# Altium schematic sheet PowerSupply.SchDoc
size 420 x 297 mm; DocumentNumber: САНП.*; _Razrabotal: {Разработал}; _Proveril: {Проверил}; _TKontr: {Т.контр}; _NKontr: {Н.контр}; _Utverdil: {Утвердил}
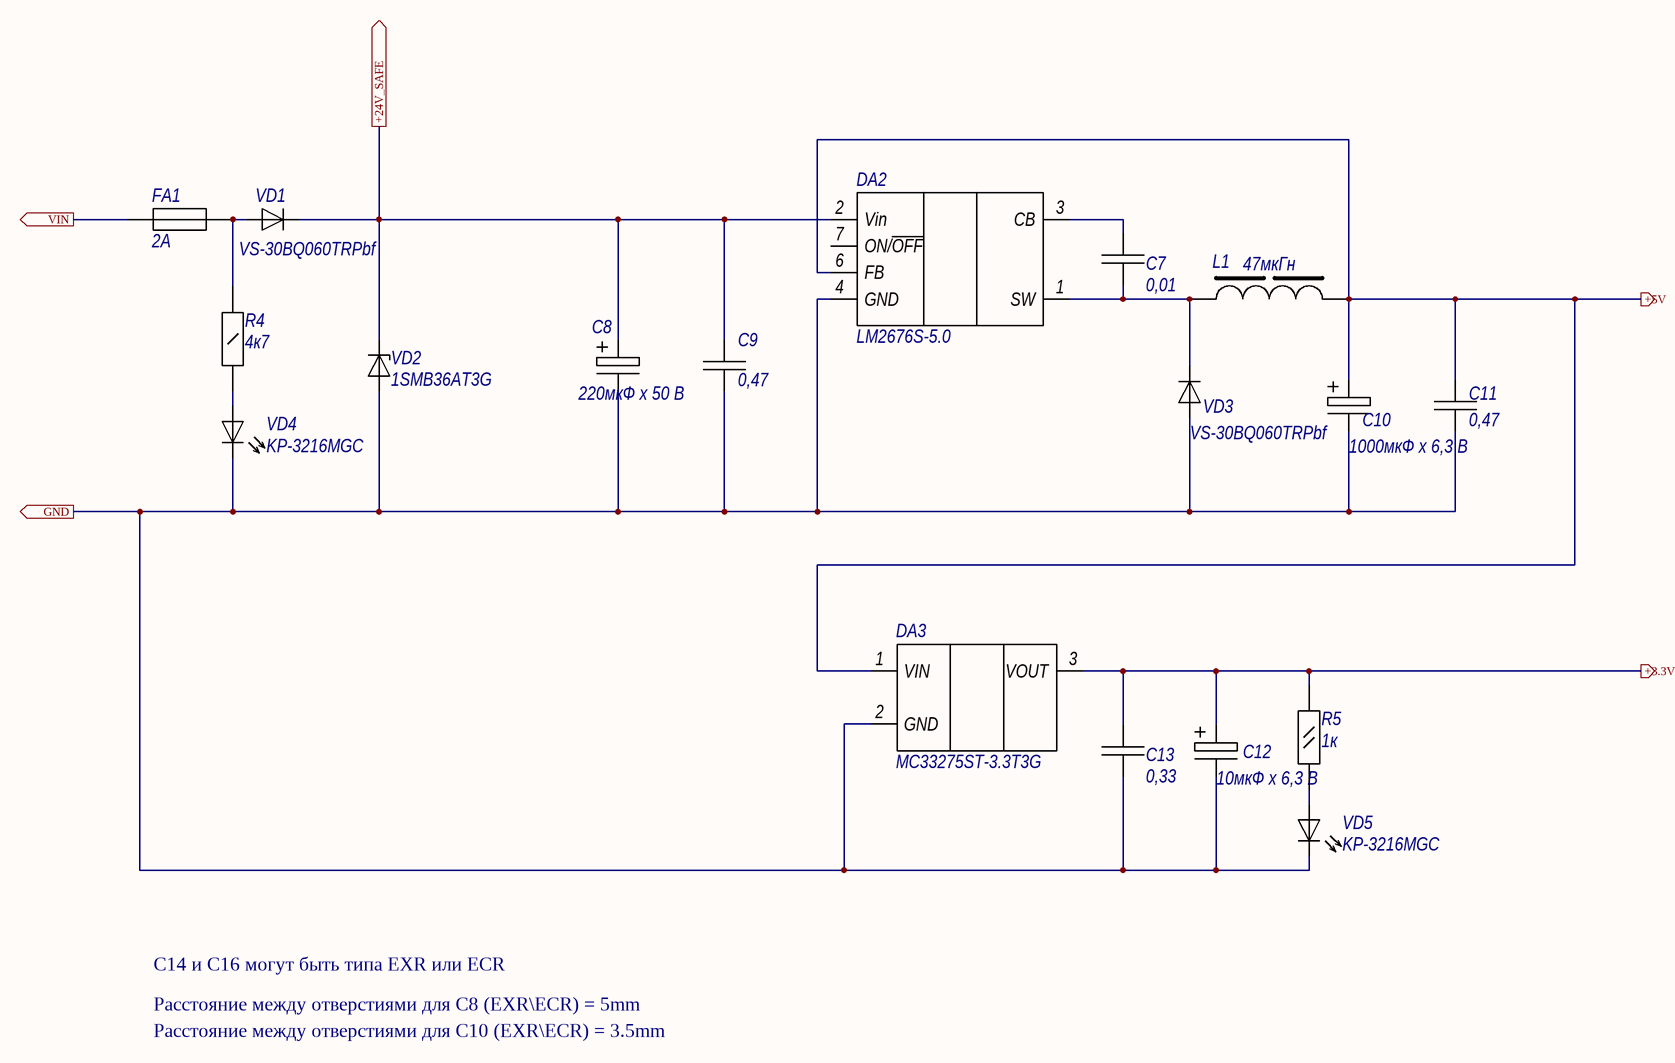
[diagram p0: PowerSupply.SchDoc]

## Parts
C7  0,01  [0805]
C8  220мкФ x 50 В  [ELCAP_SIZE_F]
C9  0,47  [1206]
C10  1000мкФ x 6,3 В  [ELCAP_SIZE_F]
C11  0,47  [1206]
C12  10мкФ x 6,3 В  [CAP_TYPE_A]
C13  0,33  [0805]
DA2  LM2676S-5.0  [DDPAK]
DA3  MC33275ST-3.3T3G  [SOT-223_2]
FA1  2А  [RUE-185]
L1  47мкГн  [B82464g4]
R4  4к7  [1206]
R5  1к  [0805]
VD1  VS-30BQ060TRPbf  [SMC]
VD2  1SMB36AT3G  [SMB]
VD3  VS-30BQ060TRPbf  [SMC]
VD4  KP-3216MGC  [LED3216]
VD5  KP-3216MGC  [LED3216]

## Ports
+3.3V, +5V, +24V_SAFE, GND, VIN

## Nets
+3.3V: C12.1 C13.1 DA3.3(VOUT) R5.2 ; port +3.3V
+5V: C10.1 C11.1 DA2.6(FB) DA3.1(VIN) L1.2 ; port +5V
+24V_SAFE: C8.1 C9.1 DA2.2(Vin) VD1.1(K) VD2.1(K) ; port +24V_SAFE
GND: C8.2 C9.2 C10.2 C11.2 C12.2 C13.2 DA2.4(GND) DA3.2(GND) VD2.2(A) VD3.2(A) VD4.2(K) VD5.2(K) ; port GND
VIN: FA1.1 ; port VIN
NetC7_1: C7.1 DA2.3(CB)
NetC7_2: C7.2 DA2.1(SW) L1.1 VD3.1(K)
NetFA1_2: FA1.2 R4.2 VD1.2(A)
NetR4_1: R4.1 VD4.1(A)
NetR5_1: R5.1 VD5.1(A)

Not connected (* = marked no-connect by the designer): DA2 7(ON/~{OFF})

## Notes on the sheet
- C14 и C16 могут быть типа EXR или ECR
- Расстояние между отверстиями для С8 (EXR\ECR) = 5mm
- Расстояние между отверстиями для С10 (EXR\ECR) = 3.5mm
- Перв. примен.
- Справ. №
- Подп. и дата
- Инв.№ дубл.
- Взам. инв.№
- Инв. № подп.
- Лист
- Изм.
- № докум.
- Подпись
- Дата
- Копировал
- Формат      А3

## Library data of the parts
C7 = CC0805: Конденсатор; Manufacturer: YAGEO; Accuracy: 10%; CVoltage: 50 В; TC Material: X7R; ComponentName: СС0805; PackageName: 0805; ComponentType: Конденсатор; Value: 0,01
C8 = EZV-F: Конденсатор электролитический; Manufacturer: HITANO; Accuracy: 20%; CVoltage: 50 В; ComponentType: Конденсатор электролитический; Value: 220мкФ; ComponentName: EZV-F
C9 C11 = CC1206: Manufacturer: YAGEO; Accuracy: 10%; CVoltage: 50 В; TC Material: X7R; ComponentName: СС1206; PackageName: 1206; ComponentType: Конденсатор; Value: 0,47
C10 = EZV-F: Конденсатор электролитический; Manufacturer: HITANO; Accuracy: 20%; CVoltage: 6,3 В; ComponentType: Конденсатор электролитический; Value: 1000мкФ; ComponentName: EZV-F
C12 = TANTAL_A: Manufacturer: Vishay; Accuracy: 20%; CVoltage: 6,3 В; ComponentName: 293D; PackageName: Тип A; ComponentType: Конденсатор электролитический танталовый; Value: 10мкФ
C13 = CC0805: Конденсатор; Manufacturer: YAGEO; Accuracy: 10%; CVoltage: 25 В; TC Material: X7R; ComponentName: СС0805; PackageName: 0805; ComponentType: Конденсатор; Value: 0,33
DA2 = LM2676S: понижающи регулятор 3 А; Manufacturer: Texas Instr.; PackageName: DDPAK; ComponentType: Микросхема; ComponentName: LM2676S-5.0
DA3 = MC33275ST: Линейный стабилизатор напряжения; Manufacturer: ON Semi.; PackageName: SOT-223; ComponentType: Микросхема; ComponentName: MC33275ST-3.3T3G
FA1 = RUE-185: Предохранитель 3,7 А 30 В; Manufacturer: Tyco; ComponentName: RUEF185; ComponentType: Предохранитель; Value: 2А
L1 = B82464g4: Силовой дроссель; Manufacturer: Epcos; ComponentName: B82464-G4473-M; ComponentType: Дроссель; Value: 47мкГн
R4 = RC1206JR: Резистор общего назначения 5%; Manufacturer: YAGEO; PackageName: 1206; ComponentType: Резистор; Accuracy: 5%; Value: 4к7; ComponentName: RC1206JR
R5 = RC0805JR: Резистор общего назначения 5%; Manufacturer: YAGEO; PackageName: 0805; ComponentType: Резистор; Accuracy: 5%; Value: 1к; ComponentName: RC0805JR
VD1 VD3 = 30BQ60: Диод Шотки 60 В 3 А; Manufacturer: Vishay; PackageName: SMC; ComponentType: Диод; ComponentName: VS-30BQ060TRPbf
VD2 = 1SMB36: Диод защитный 600 Вт 36 В; Manufacturer: On Semi.; PackageName: SMB; ComponentType: Стабилитрон; ComponentName: 1SMB36AT3G
VD4 VD5 = KP-3216: Светодиод; Manufacturer: Kingbright; ComponentType: Светодиод; ComponentName: KP-3216MGC